# Altium schematic sheet Regulator.SchDoc
size A4; SheetNumber: 7; SheetTotal: 7
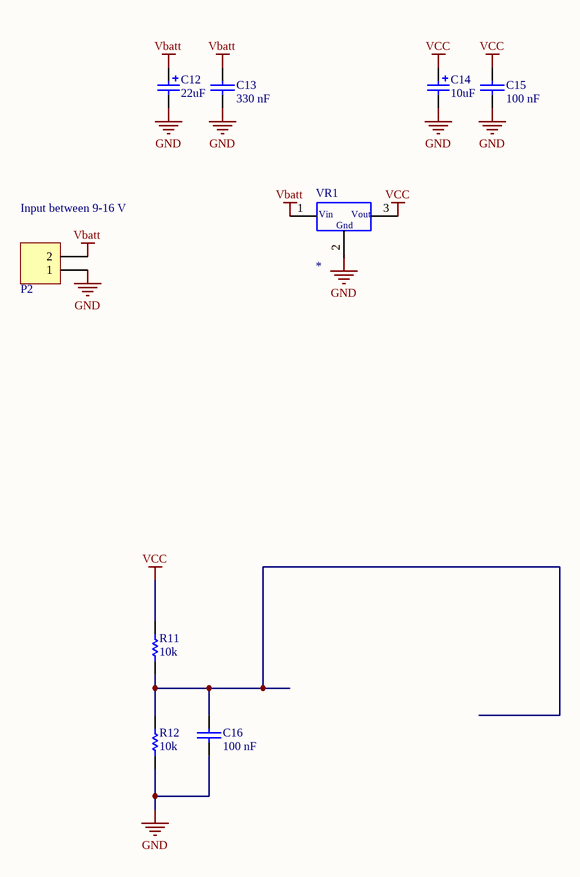
[diagram p0: Regulator.SchDoc]

## Parts
C12  22uF  [ece-CAPAD2TH0.3]
C13  330 nF  [ece-RAD0.2]
C14  10uF  [ece-CAPAD2TH0.3]
C15  100 nF  [ece-RAD0.2]
C16  100 nF  [ece-RAD0.2]
P2  Connector2way  [ece-TER-2.02]  (value not drawn)
R11  10k  [ece-AXIAL0.4]
R12  10k  [ece-AXIAL0.4]
VR1  *  [ece-TO220]

## Nets
GND: C12.2 C13.2 C14.2 C15.2 C16.2 P2.1 R12.1 VR1.2(Gnd)
Vbatt: C12.1 C13.1 P2.2 VR1.1(Vin)
VCC: C14.1 C15.1 R11.2 VR1.3(Vout)
NetC16_1: C16.1 R11.1 R12.2

## Notes on the sheet
- (near P2) Input between 9-16 V

## Library data of the parts
C12 C14 = CAP 22uF TH: Polarized Capacitor (Radial); Manufacturer: Generic Components; Class I: Passive; Published: 8-Jun-2000; Revision: July-2002: Re-released for DXP Platform.; Publisher: Altium Limited; Class II: Capacitor
  C12: Value: 22uF
  C14: Value: 10uF
C13 C15 C16 = CAP: Capacitor Non Polarised Through Hole
  C13: Value: 330 nF
  C15 C16: Value: 100 nF
P2 = Connector2way: 2 way screw connector
R11 R12 = Res1: Resistor; Published: 8-Jun-2000; LatestRevisionDate: 17-Jul-2002; LatestRevisionNote: Re-released for DXP Platform.; PackageReference: AXIAL-0.3; Publisher: Altium Limited; Value: 10k
VR1 = VoltRegBig: Voltage Regulator; Value: *